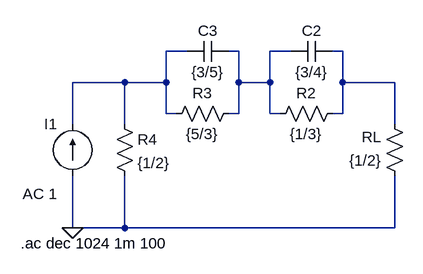
[diagram p0: schematic Draft1.asc]
Draft1.asc, the LTspice schematic file:
Version 4
SHEET 1 880 680
WIRE 144 -16 112 -16
WIRE 224 -16 208 -16
WIRE 304 -16 272 -16
WIRE 384 -16 368 -16
WIRE 48 32 -32 32
WIRE 112 32 112 -16
WIRE 112 32 48 32
WIRE 224 32 224 -16
WIRE 272 32 272 -16
WIRE 272 32 224 32
WIRE 384 32 384 -16
WIRE 464 32 384 32
WIRE 112 80 112 32
WIRE 128 80 112 80
WIRE 224 80 224 32
WIRE 224 80 208 80
WIRE 272 80 272 32
WIRE 288 80 272 80
WIRE 384 80 384 32
WIRE 384 80 368 80
WIRE -32 96 -32 32
WIRE 48 96 48 32
WIRE 464 96 464 32
WIRE -32 256 -32 176
WIRE 48 256 48 176
WIRE 48 256 -32 256
WIRE 464 256 464 176
WIRE 464 256 48 256
FLAG -32 256 0
SYMBOL res 480 192 R180
WINDOW 0 36 76 Left 2
WINDOW 3 36 40 Left 2
SYMATTR InstName RL
SYMATTR Value {1/2}
SYMBOL current -32 176 R180
WINDOW 0 24 80 Left 2
WINDOW 3 24 0 Left 2
WINDOW 123 24 -28 Left 2
WINDOW 39 0 0 Left 0
SYMATTR InstName I1
SYMATTR Value ""
SYMATTR Value2 AC 1
SYMBOL cap 368 -32 R90
WINDOW 0 0 32 VBottom 2
WINDOW 3 32 32 VTop 2
SYMATTR InstName C2
SYMATTR Value {3/4}
SYMBOL res 384 64 R90
WINDOW 0 0 56 VBottom 2
WINDOW 3 32 56 VTop 2
SYMATTR InstName R2
SYMATTR Value {1/3}
SYMBOL cap 208 -32 R90
WINDOW 0 0 32 VBottom 2
WINDOW 3 32 32 VTop 2
SYMATTR InstName C3
SYMATTR Value {3/5}
SYMBOL res 224 64 R90
WINDOW 0 0 56 VBottom 2
WINDOW 3 32 56 VTop 2
SYMATTR InstName R3
SYMATTR Value {5/3}
SYMBOL res 32 80 R0
SYMATTR InstName R4
SYMATTR Value {1/2}
TEXT -112 280 Left 2 !.ac dec 1024 1m 100

The netlist it stands for:
* Draft1.asc
RL 0 N003 {1/2}
I1 0 N001 AC 1
C2 N003 N002 {3/4}
R2 N003 N002 {1/3}
C3 N002 N001 {3/5}
R3 N002 N001 {5/3}
R4 N001 0 {1/2}
.ac dec 1024 1m 100
.backanno
.end